# Altium schematic sheet Zigbee控制板.SchDoc: Zigbee控制板
size A4; Author: 李尧; Revision: V1.0; CurrentDate: 2016年10月11日
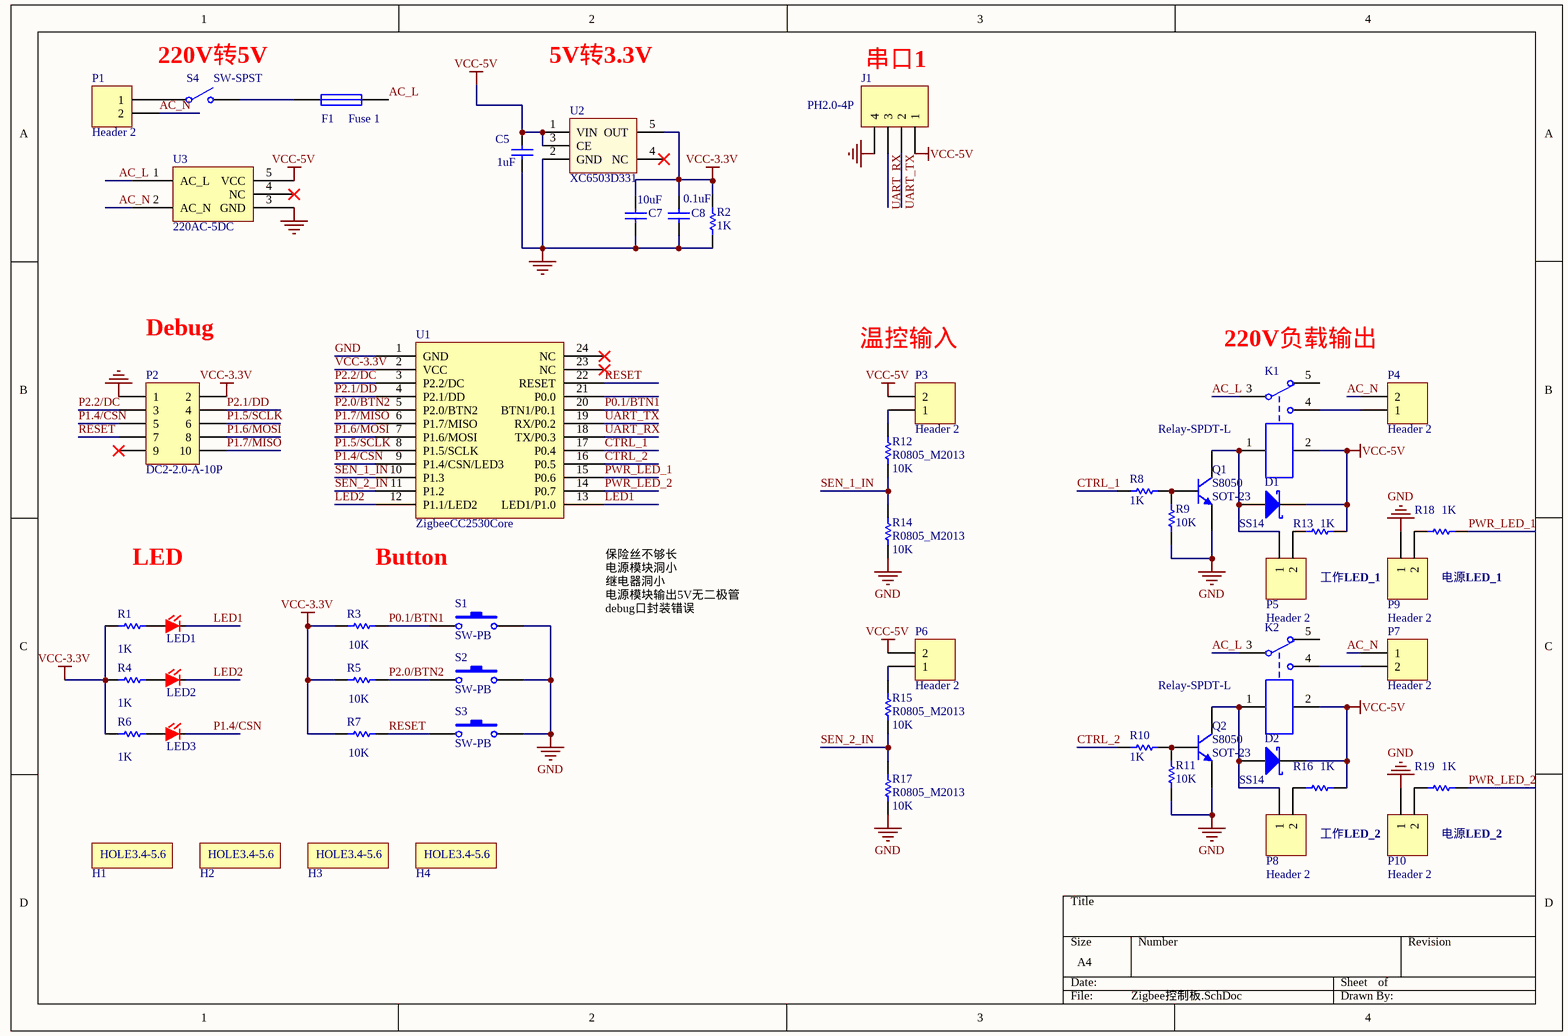
[diagram p0: Zigbee控制板.SchDoc]

## Parts
C5  1uF  [C0805_M2013]
C7  10uF  [C0805_M2013]
C8  0.1uF  [C0805_M2013]
D1  value SS14  [SMA DO-214AC]  (hidden comment: SMA DO-214AC)
D2  value SS14  [SMA DO-214AC]  (hidden comment: SMA DO-214AC)
F1  Fuse 1  [POLAR0.8]
H1  HOLE3.4-5.6  [HOLE3.4-5.6]  (value not drawn)
H2  HOLE3.4-5.6  [HOLE3.4-5.6]  (value not drawn)
H3  HOLE3.4-5.6  [HOLE3.4-5.6]  (value not drawn)
H4  HOLE3.4-5.6  [HOLE3.4-5.6]  (value not drawn)
J1  PH2.0-4P  [PH2.0-4P]
K1  Relay-SPDT-L  [Relay-SPDT-L]
K2  Relay-SPDT-L  [Relay-SPDT-L]
LED1  LED-R  [0805_LED]  (value not drawn)
LED2  LED-R  [0805_LED]  (value not drawn)
LED3  LED-R  [0805_LED]  (value not drawn)
P1  Header 2  [KF301-2P]
P2  DC2-2.0-A-10P  [DC3-2.0-A-10P]
P3  Header 2  [HDR1X2]
P4  Header 2  [KF301-2P]
P5  Header 2  [HDR1X2]
P6  Header 2  [HDR1X2]
P7  Header 2  [KF301-2P]
P8  Header 2  [HDR1X2]
P9  Header 2  [HDR1X2]
P10  Header 2  [HDR1X2]
Q1  SOT-23  value S8050  [SOT-23-3]
Q2  SOT-23  value S8050  [SOT-23-3]
R1  value 1K  [R0805_M2013]  (hidden comment: R0805_M2013)
R2  1K  [R0805_M2013]
R3  value 10K  [R0805_M2013]  (hidden comment: R0805_M2013)
R4  value 1K  [R0805_M2013]  (hidden comment: R0805_M2013)
R5  value 10K  [R0805_M2013]  (hidden comment: R0805_M2013)
R6  value 1K  [R0805_M2013]  (hidden comment: R0805_M2013)
R7  value 10K  [R0805_M2013]  (hidden comment: R0805_M2013)
R8  1K  [R0805_M2013]
R9  10K  [R0805_M2013]
R10  1K  [R0805_M2013]
R11  10K  [R0805_M2013]
R12  R0805_M2013  value 10K  [R0805_M2013]
R13  value 1K  [R0805_M2013]  (hidden comment: R0805_M2013)
R14  R0805_M2013  value 10K  [R0805_M2013]
R15  R0805_M2013  value 10K  [R0805_M2013]
R16  value 1K  [R0805_M2013]  (hidden comment: R0805_M2013)
R17  R0805_M2013  value 10K  [R0805_M2013]
R18  value 1K  [R0805_M2013]  (hidden comment: R0805_M2013)
R19  value 1K  [R0805_M2013]  (hidden comment: R0805_M2013)
S1  SW-PB  [SW-KEY]
S2  SW-PB  [SW-KEY]
S3  SW-PB  [SW-KEY]
S4  SW-SPST  [SW-SHIP]
U1  ZigbeeCC2530Core  [CC2530_CORE]
U2  XC6503D331  [SOT23-5]
U3  220AC-5DC  [220AC-5DC]

## Nets
GND: C5.1 C7.2 C8.2 J1.4 P2.1 P9.1 P10.1 Q1.2(E) Q2.2(E) R2.1 R9.1 R11.1 R14.1 R17.1 S1.2 S2.2 S3.2 U1.1(GND) U2.2(GND) U3.3(GND)
VCC-3.3V: C7.1 C8.1 P2.2 R1.1 R2.2 R3.1 R4.1 R5.1 R6.1 R7.1 U1.2(VCC) U2.5(OUT)
VCC-5V: C5.2 D1.2(K) D2.2(K) J1.1 K1.2 K2.2 P3.2 P6.2 R13.1 R16.1 U2.1(VIN) U2.3(CE) U3.5(VCC)
AC_L: F1.2 K1.3 K2.3 U3.1(AC_L)
AC_N: P1.2 P4.2 P7.1 U3.2(AC_N)
CTRL_1: R8.2 U1.17(P0.4)
CTRL_2: R10.2 U1.16(P0.5)
LED1: LED1.2 U1.13(LED1/P1.0)
LED2: LED2.2 U1.12(P1.1/LED2)
P0.1/BTN1: R3.2 S1.1 U1.20(BTN1/P0.1)
P1.4/CSN: LED3.2 P2.5 U1.9(P1.4/CSN/LED3)
P1.5/SCLK: P2.6 U1.8(P1.5/SCLK)
P1.6/MOSI: P2.8 U1.7(P1.6/MOSI)
P1.7/MISO: P2.10 U1.6(P1.7/MISO)
P2.0/BTN2: R5.2 S2.1 U1.5(P2.0/BTN2)
P2.1/DD: P2.4 U1.4(P2.1/DD)
P2.2/DC: P2.3 U1.3(P2.2/DC)
PWR_LED_1: R18.1 U1.15(P0.6)
PWR_LED_2: R19.1 U1.14(P0.7)
RESET: P2.7 R7.2 S3.1 U1.22(RESET)
SEN_1_IN: R12.1 R14.2 U1.10(P1.3)
SEN_2_IN: R15.1 R17.2 U1.11(P1.2)
UART_RX: J1.3 U1.18(TX/P0.3)
UART_TX: J1.2 U1.19(RX/P0.2)
NetD1_1: D1.1(A) K1.1 P5.1 Q1.3(C)
NetD2_1: D2.1(A) K2.1 P8.1 Q2.3(C)
NetF1_1: F1.1 S4.2(NO)
NetK1_4: K1.4 P4.1
NetK2_4: K2.4 P7.2
NetLED1_1: LED1.1 R1.2
NetLED2_1: LED2.1 R4.2
NetLED3_1: LED3.1 R6.2
NetP1_1: P1.1 S4.1(COMMON)
NetP3_1: P3.1 R12.2
NetP5_2: P5.2 R13.2
NetP6_1: P6.1 R15.2
NetP8_2: P8.2 R16.2
NetP9_2: P9.2 R18.2
NetP10_2: P10.2 R19.2
NetQ1_1: Q1.1(B) R8.1 R9.2
NetQ2_1: Q2.1(B) R10.1 R11.2

Not connected (* = marked no-connect by the designer): K1 5; K2 5; P2 9*; U1 21(P0.0) 23(NC)* 24(NC)*; U2 4(NC)*; U3 4(NC)*

## Notes on the sheet
- 220V转5V
- 5V转3.3V
- (near J1) 串口1
- Debug
- (near P3) 温控输入
- (near K1) 220V负载输出
- LED
- Button
- 工作LED_1
- 电源LED_1
- 保险丝不够长
  电源模块洞小
  继电器洞小
  电源模块输出5V无二极管
  debug口封装错误
- 工作LED_2
- 电源LED_2

## Library data of the parts
C5 C7 C8 = Cap: Capacitor; Published: 8-Jun-2000; LatestRevisionDate: 17-Jul-2002; LatestRevisionNote: Re-released for DXP Platform.; PackageReference: RAD-0.3; Publisher: Altium Limited; PackageDescription: Radial Cap, Thru-Hole; 2 Leads; 0.3 in Pin Spacing
  C5: Value: 1uF
  C7: Value: 10uF
  C8: Value: 0.1uF
D1 D2 = SS14: 1.0 A Schottky Barrier Rectifiers
F1 = Fuse 1: Fuse; Published: 8-Jun-2000; LatestRevisionDate: 17-Jul-2002; LatestRevisionNote: Re-released for DXP Platform.; PackageReference: PIN-W2/E2.8; Publisher: Altium Limited; PackageDescription: Thru-Hole; 2 Leads
H1-H4 = HOLE3.4-5.6: Value: NC
J1 = Header 4: Header, 4-Pin; LatestRevisionDate: 17-Jul-2002; LatestRevisionNote: Re-released for DXP Platform.; Publisher: Altium Limited; Value: PH2.0-4P
K1 K2 = Relay-SPDT-L: Single-Pole Dual-Throw Relay; Published: 24-Mar-1999; LatestRevisionDate: 17-Jul-2002; LatestRevisionNote: Re-released for DXP Platform.; PackageReference: MODULE5B; Publisher: Altium Limited
LED1-LED3 = LED-R: LED红
P1 P3-P10 = Header 2: Header, 2-Pin; LatestRevisionDate: 17-Jul-2002; LatestRevisionNote: Re-released for DXP Platform.; Publisher: Altium Limited
P2 = DC2-2.0-A-10P: 牛角座2.0 直插; Value: DC2-2.0-A-10P
Q1 Q2 = NPN: NPN Bipolar Transistor; Published: 8-Jun-2000; LatestRevisionDate: 17-Jul-2002; LatestRevisionNote: Re-released for DXP Platform.; PackageReference: TO-226-AA; Publisher: Altium Limited; PackageDescription: TO, Flat Index; 3 In-Line, Axial Leads; Body Dia. 4.8mm; Leads 0.55 x 0.51 mm (max); Code_JEDEC: TO-226-AA
R1 R3-R7 R12-R19 = R0805_M2013: Resistor
R2 R8-R11 = Res1: Resistor; Published: 8-Jun-2000; LatestRevisionDate: 17-Jul-2002; LatestRevisionNote: Re-released for DXP Platform.; PackageReference: AXIAL-0.3; Publisher: Altium Limited; PackageDescription: Axial Device, Thru-Hole; 2 Leads; 0.3 in Pin Spacing
  R2 R8 R10: Value: 1K
  R9 R11: Value: 10K
S1-S3 = SW-PB: Switch; Published: 24-Mar-1999; LatestRevisionDate: 17-Jul-2002; LatestRevisionNote: Re-released for DXP Platform.; PackageReference: SPST-2; Publisher: Altium Limited; PackageDescription: Switch; 2 Leads
S4 = SW-SPST: Single-Pole, Single-Throw Switch; Published: 24-Mar-1999; LatestRevisionDate: 17-Jul-2002; LatestRevisionNote: Re-released for DXP Platform.; PackageReference: SPST-2; Publisher: Altium Limited; PackageDescription: Switch; 2 Leads
U2 = XC6503Dxxx: Value: XC6503D331
U3 = 220AC-5DC: 220VAC转5VDC模块